# EAGLE design hairpin-L-band (EAGLE 9.5.1)
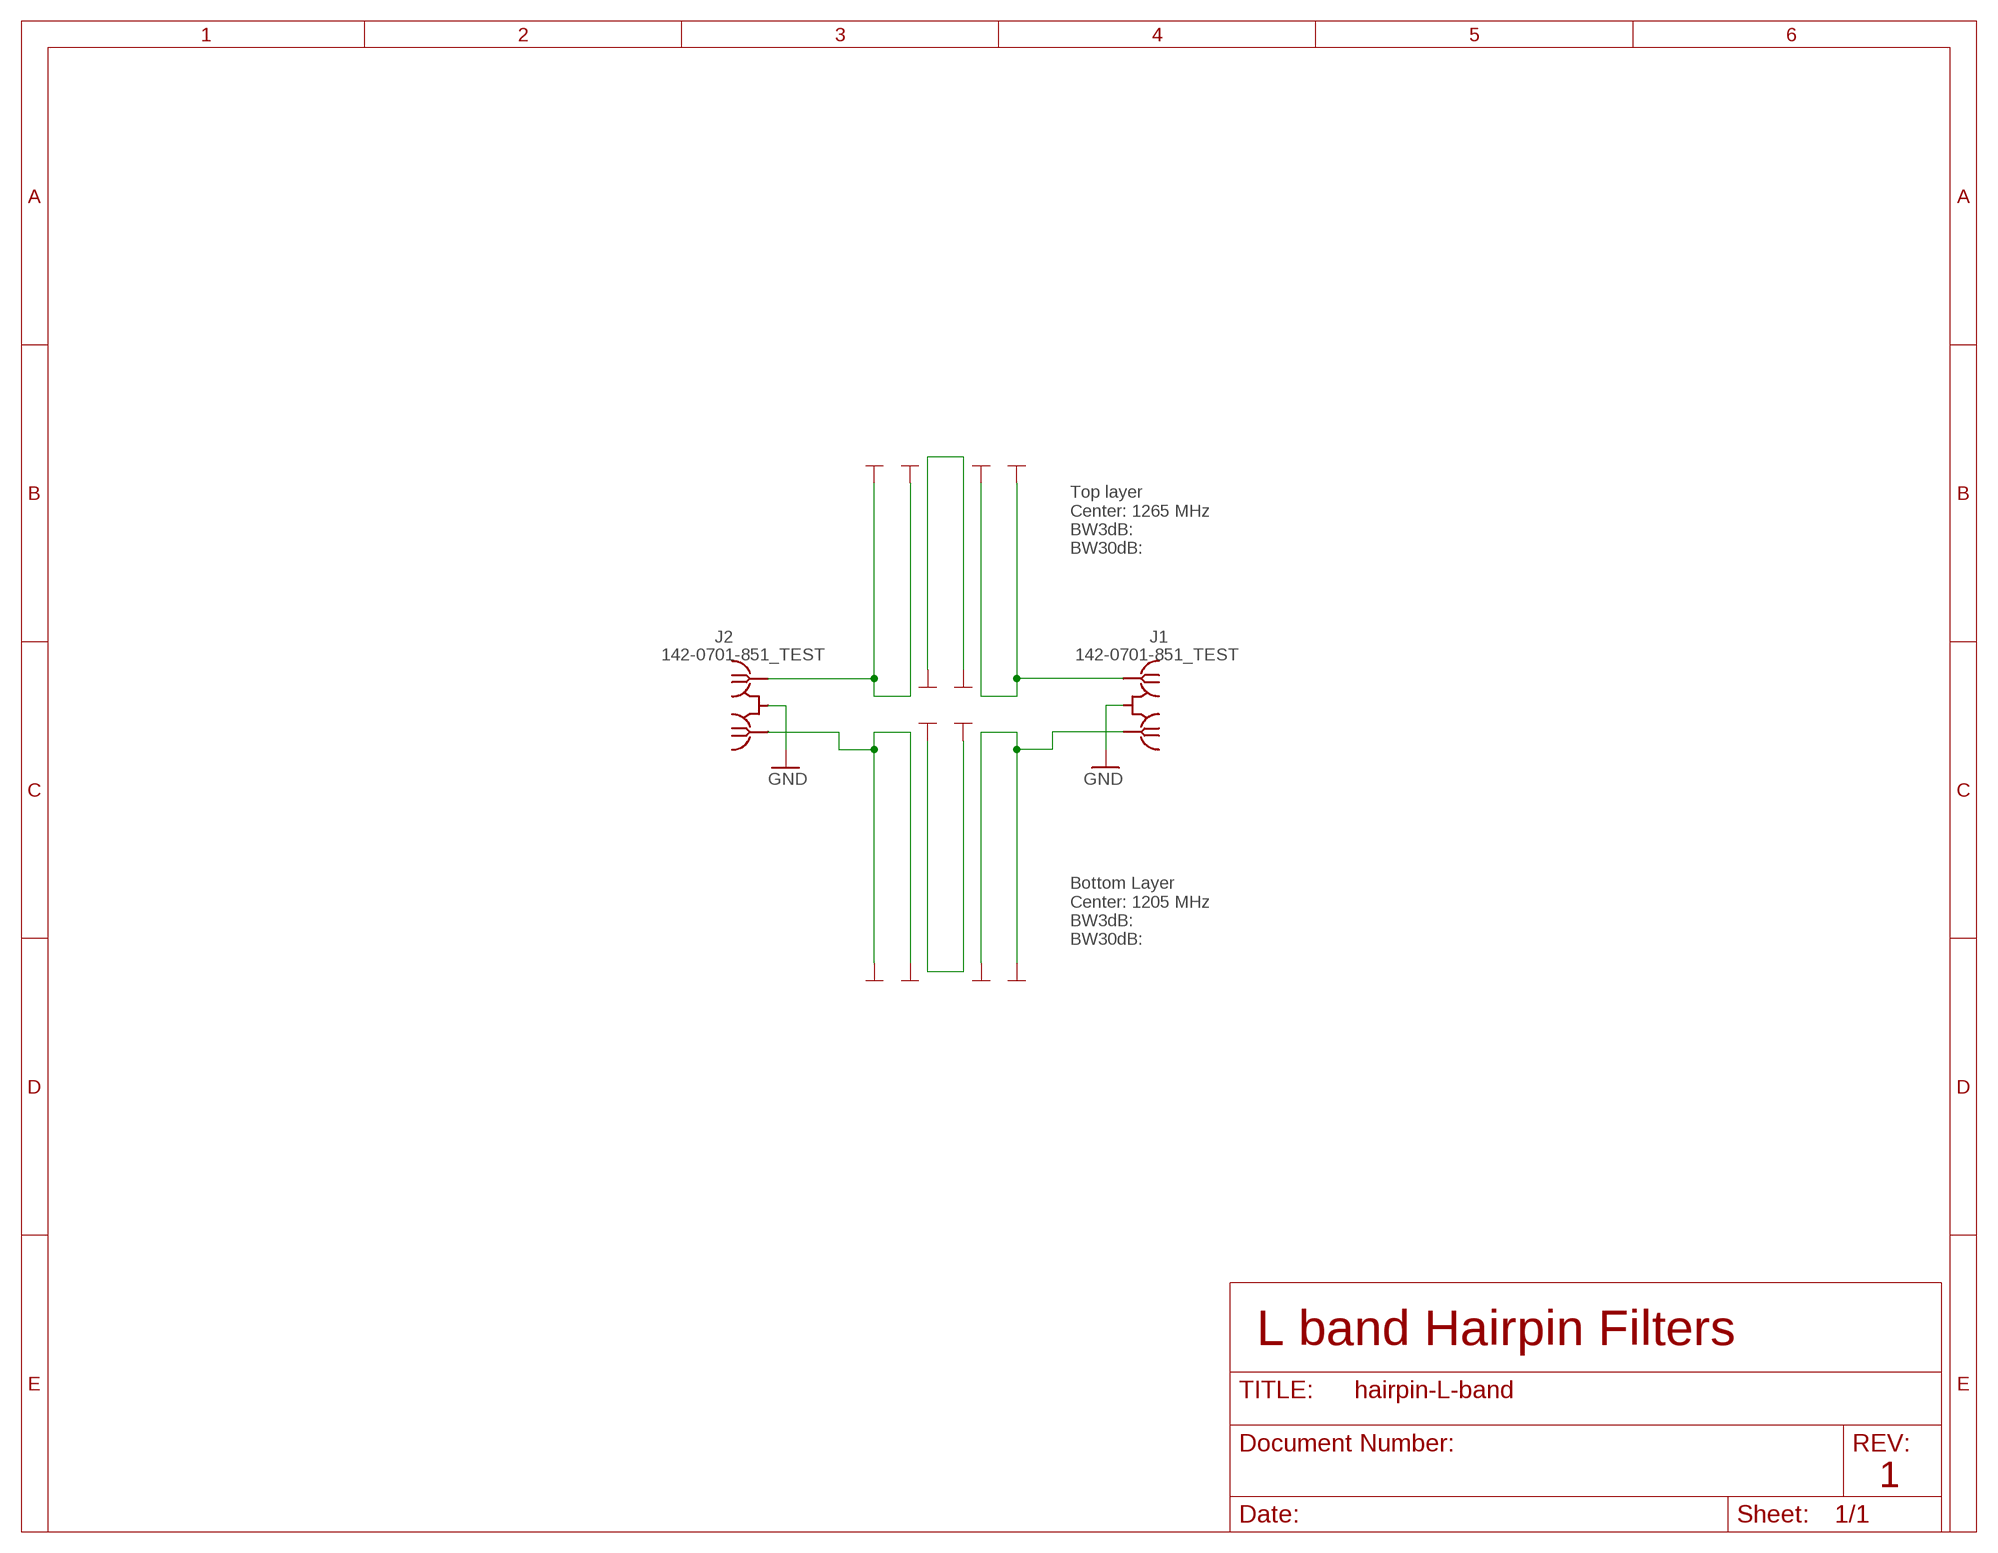
[diagram p0: schematic, sheet 1]

## Parts
J1  142-0701-851_TEST  [142-0701-851_TEST]
J2  142-0701-851_TEST  [142-0701-851_TEST]
U$1  PAD_0.6  [0.6MM]
U$2  PAD_0.6  [0.6MM]
U$3  PAD_0.6  [0.6MM]
U$4  PAD_0.6  [0.6MM]
U$5  PAD_0.6  [0.6MM]
U$6  PAD_0.6  [0.6MM]
U$7  PAD_0.6_B  [0.6MM_B]
U$8  PAD_0.6_B  [0.6MM_B]
U$9  PAD_0.6_B  [0.6MM_B]
U$10  PAD_0.6_B  [0.6MM_B]
U$11  PAD_0.6_B  [0.6MM_B]
U$12  PAD_0.6_B  [0.6MM_B]

## Nets
BLEFT [RF]: J2.RF2 U$11.END U$12.END
BMID [RF]: U$9.END U$10.END
BRIGHT [RF]: J1.RF2 U$7.END U$8.END
GND: J1.GND1(GND) J1.GND2(GND) J1.GND3(GND) J1.GND4(GND) J2.GND1(GND) J2.GND2(GND) J2.GND3(GND) J2.GND4(GND)
TLEFT [RF]: J2.RF1 U$5.END U$6.END
TMID [RF]: U$3.END U$4.END
TRIGHT [RF]: J1.RF1 U$1.END U$2.END

## Notes on the sheet
- Top layer
  Center: 1265 MHz
  BW3dB:
  BW30dB:
- Bottom Layer
  Center: 1205 MHz
  BW3dB:
  BW30dB:
- L band Hairpin Filters
- 1

## Library data of the parts
J1 J2 = J-Cinch-142-0701-851-SMA-end-launch:142-0701-851_TEST: SMA Jack 50Ω - End Launch Note: This test part is meant to use the SMA jack on either side; a PCB with microstrips on the top and bottom layers. Source: Datasheet <https://belfuse.com/resources/productinformations/cinchconnectivitysolutions/johnson/pi-ccs-john-142-0701-851.pdf>
U$1-U$6 = hairpin-dummy-pad:PAD_0.6
U$7-U$12 = hairpin-dummy-pad:PAD_0.6_B

## Net classes
1 RF: clearance 0.9 mm

## Board
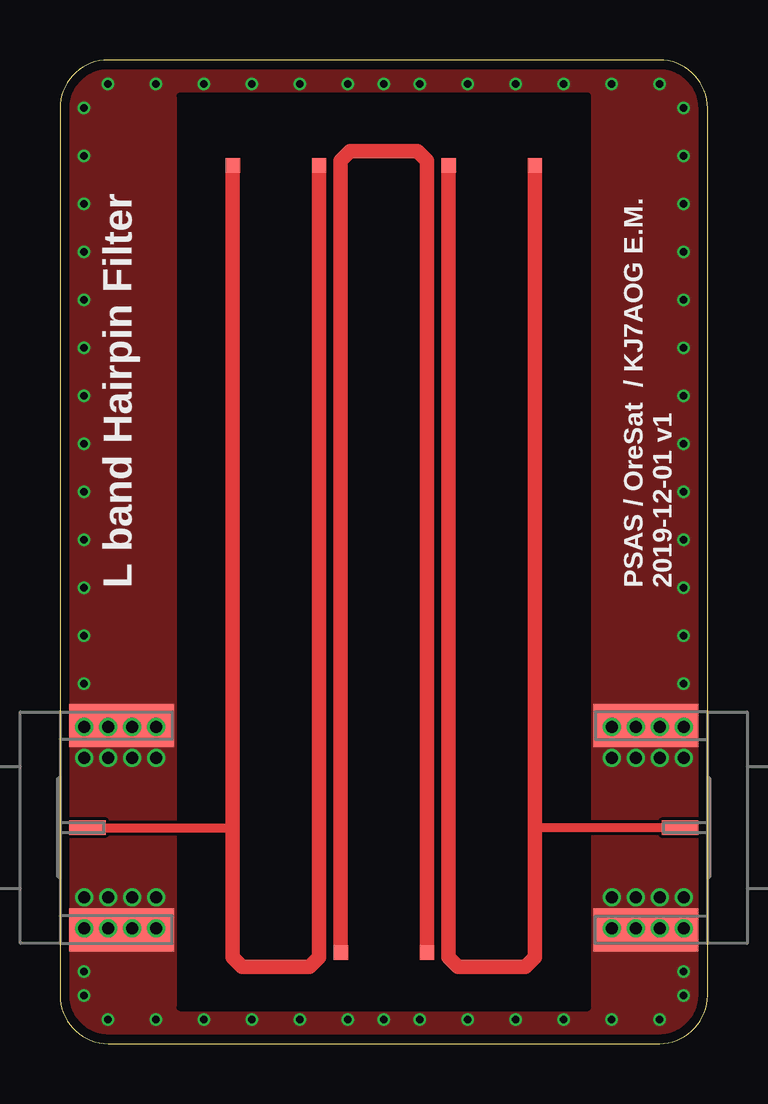
[diagram p1: board, top side]
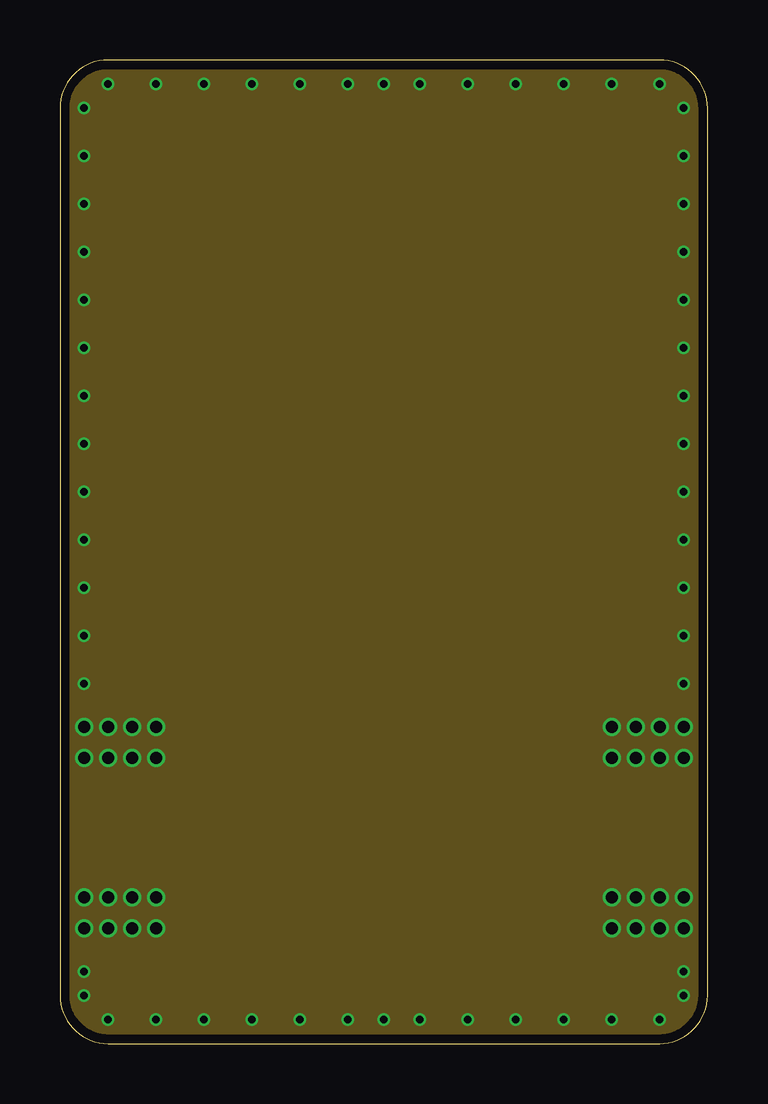
[diagram p2: board, inner layer Route2]
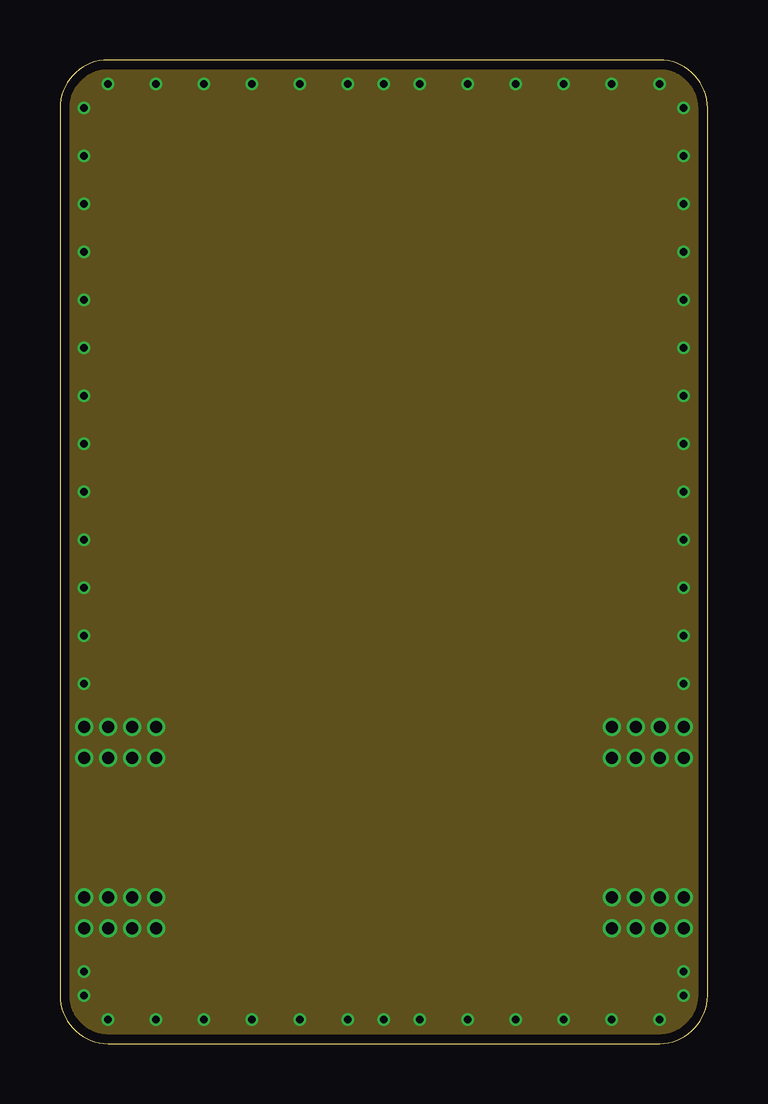
[diagram p3: board, inner layer Route15]
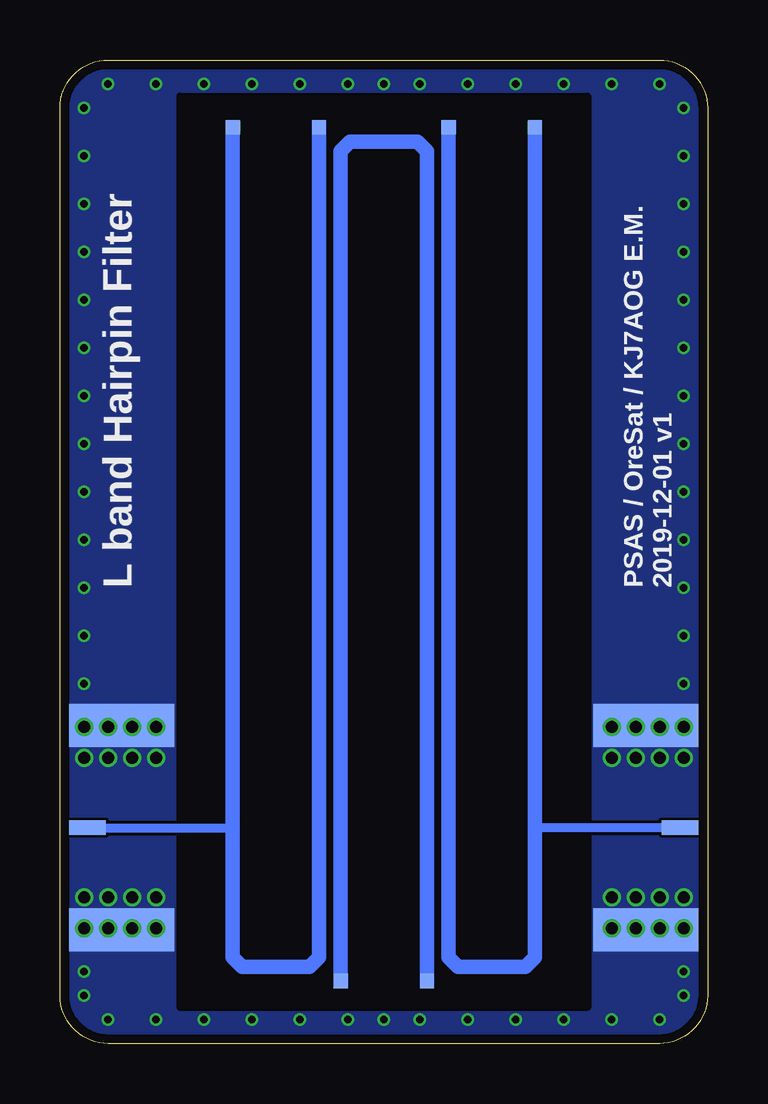
[diagram p4: board, bottom side, seen from below]

Size 27 x 41 mm. Coordinates in mm from the lower left corner, seen from the top.
Outline: 0,39 0,2 arc90 2,0 25,0 arc90 27,2 27,39 arc90 25,41 2,41 arc90 0,39
Copper layers (1*2*15*16): Top 0.035559375mm / dielectric 0.17018125mm / Route2 0.01778125mm / dielectric 47mil / Route15 0.01778125mm / dielectric 0.17018125mm / Bottom 0.035559375mm
Design rules "oshpark-4layer-tented": minimum track width 5mil, minimum drill 10mil, track to track 5mil, track to pad 5mil, pad to pad 5mil, via to via 5mil, smd to smd 5mil, copper to edge 15mil, drill to drill 6mil, minimum pad ring 4mil, minimum via ring 4mil, stop-mask expansion 2.5mil, vias tented up to drill 20mil, thermal gap 10mil

### Footprints (pad centres in the part's own frame; a part is rotated, then mirrored left to right if it is on the bottom)
142-0701-851_TEST = smd 1.8 x 4.37: GND1 -4.255,-2.566; GND2 4.255,-2.566 | smd 1.8 x 4.37 bottom: GND3 -4.255,-2.566; GND4 4.255,-2.566 | smd 0.6 x 1.53: RF1 0,-1.146 | smd 0.6 x 1.53 bottom: RF2 0,-1.146
0.6MM = smd 0.6 x 0.6: END 0,0
0.6MM_B = smd 0.6 x 0.6 bottom: END 0,0

### Placement (x,y rotation side)
J1  27,9 270 top
J2  0,9 90 top
U$1  19.8,36.6 180 top
U$2  16.2,36.6 180 top
U$3  15.3,3.8 180 top
U$4  11.7,3.8 180 top
U$5  7.2,36.6 180 top
U$6  10.8,36.6 180 top
U$7  19.8,38.2 180 top
U$8  16.2,38.2 180 top
U$9  15.3,2.6 180 top
U$10  11.7,2.6 180 top
U$11  7.2,38.2 180 top
U$12  10.8,38.2 180 top

### Tracks (layer width: path | path; a pad name or v marks a point on that pad's centre or on a via)
BLEFT
  Bottom 0.38: J2.RF2 7.2,9
  Bottom 0.6: U$12.END 10.8,3.6 10.4,3.2 7.6,3.2 7.2,3.6 7.2,9 7.2,32 U$11.END
BMID
  Bottom 0.6: U$9.END 15.3,37.2 14.9,37.6 12.1,37.6 11.7,37.2 U$10.END
BRIGHT
  Bottom 0.38: J1.RF2 19.8,9
  Bottom 0.6: U$7.END 19.8,32 19.8,9 19.8,3.6 19.4,3.2 16.6,3.2 16.2,3.6 U$8.END
GND  (via drill 0.3, 0.5)
  other vias: 1,13.2 2,13.2 3,13.2 4,13.2 1,11.9 2,11.9 3,11.9 4,11.9 1,4.8 2,4.8 3,4.8 4,4.8 4,6.1 3,6.1 2,6.1 1,6.1 23,4.8 24,4.8 25,4.8 26,4.8 26,6.1 25,6.1 24,6.1 23,6.1 23,13.2 24,13.2 25,13.2 26,13.2 23,11.9 24,11.9 25,11.9 26,11.9 1,2 2,1 25,1 26,2 4,1 6,1 8,1 21,1 23,1 1,39 2,40 4,40 6,40 8,40 21,40 23,40 25,40 26,39 10,1 12,1 13.5,1 15,1 17,1 19,1 10,40 13.5,40 12,40 15,40 19,40 17,40 1,37 1,35 1,33 1,31 1,29 1,27 1,25 1,23 1,21 1,19 1,17 26,37 26,35 26,33 26,31 26,29 26,27 26,25 26,23 26,21 26,19 26,17 1,15 26,15 1,3 26,3
  pour Route2 (no thermals): 0,41 27,41 27,0 0,0
  pour Route15 (no thermals): 0,41 27,41 27,0 0,0
  pour Bottom (no thermals): 0,41 27,41 27,0 0,0
  pour Top (no thermals): 0,41 27,41 27,0 0,0
  cutout Top (no thermals): 5,1.5 22,1.5 22,39.5 5,39.5
  cutout Bottom (no thermals): 5,1.5 22,1.5 22,39.5 5,39.5
TLEFT
  Top 0.38: J2.RF1 7.2,9
  Top 0.6: U$6.END 10.8,3.6 10.4,3.2 7.6,3.2 7.2,3.6 7.2,9 7.2,32 U$5.END
TMID
  Top 0.6: U$3.END 15.3,36.8 14.9,37.2 12.1,37.2 11.7,36.8 U$4.END
TRIGHT
  Top 0.38: J1.RF1 19.8,9
  Top 0.6: U$1.END 19.8,32 19.8,9 19.8,3.6 19.4,3.2 16.6,3.2 16.2,3.6 U$2.END

### Text on the board
tPlace: L band Hairpin Filter | PSAS / OreSat / KJ7AOG E.M. / 2019-12-01 v1
bPlace: PSAS / OreSat / KJ7AOG E.M. / 2019-12-01 v1 | L band Hairpin Filter